# EAGLE design Eagle (EAGLE 6.3)
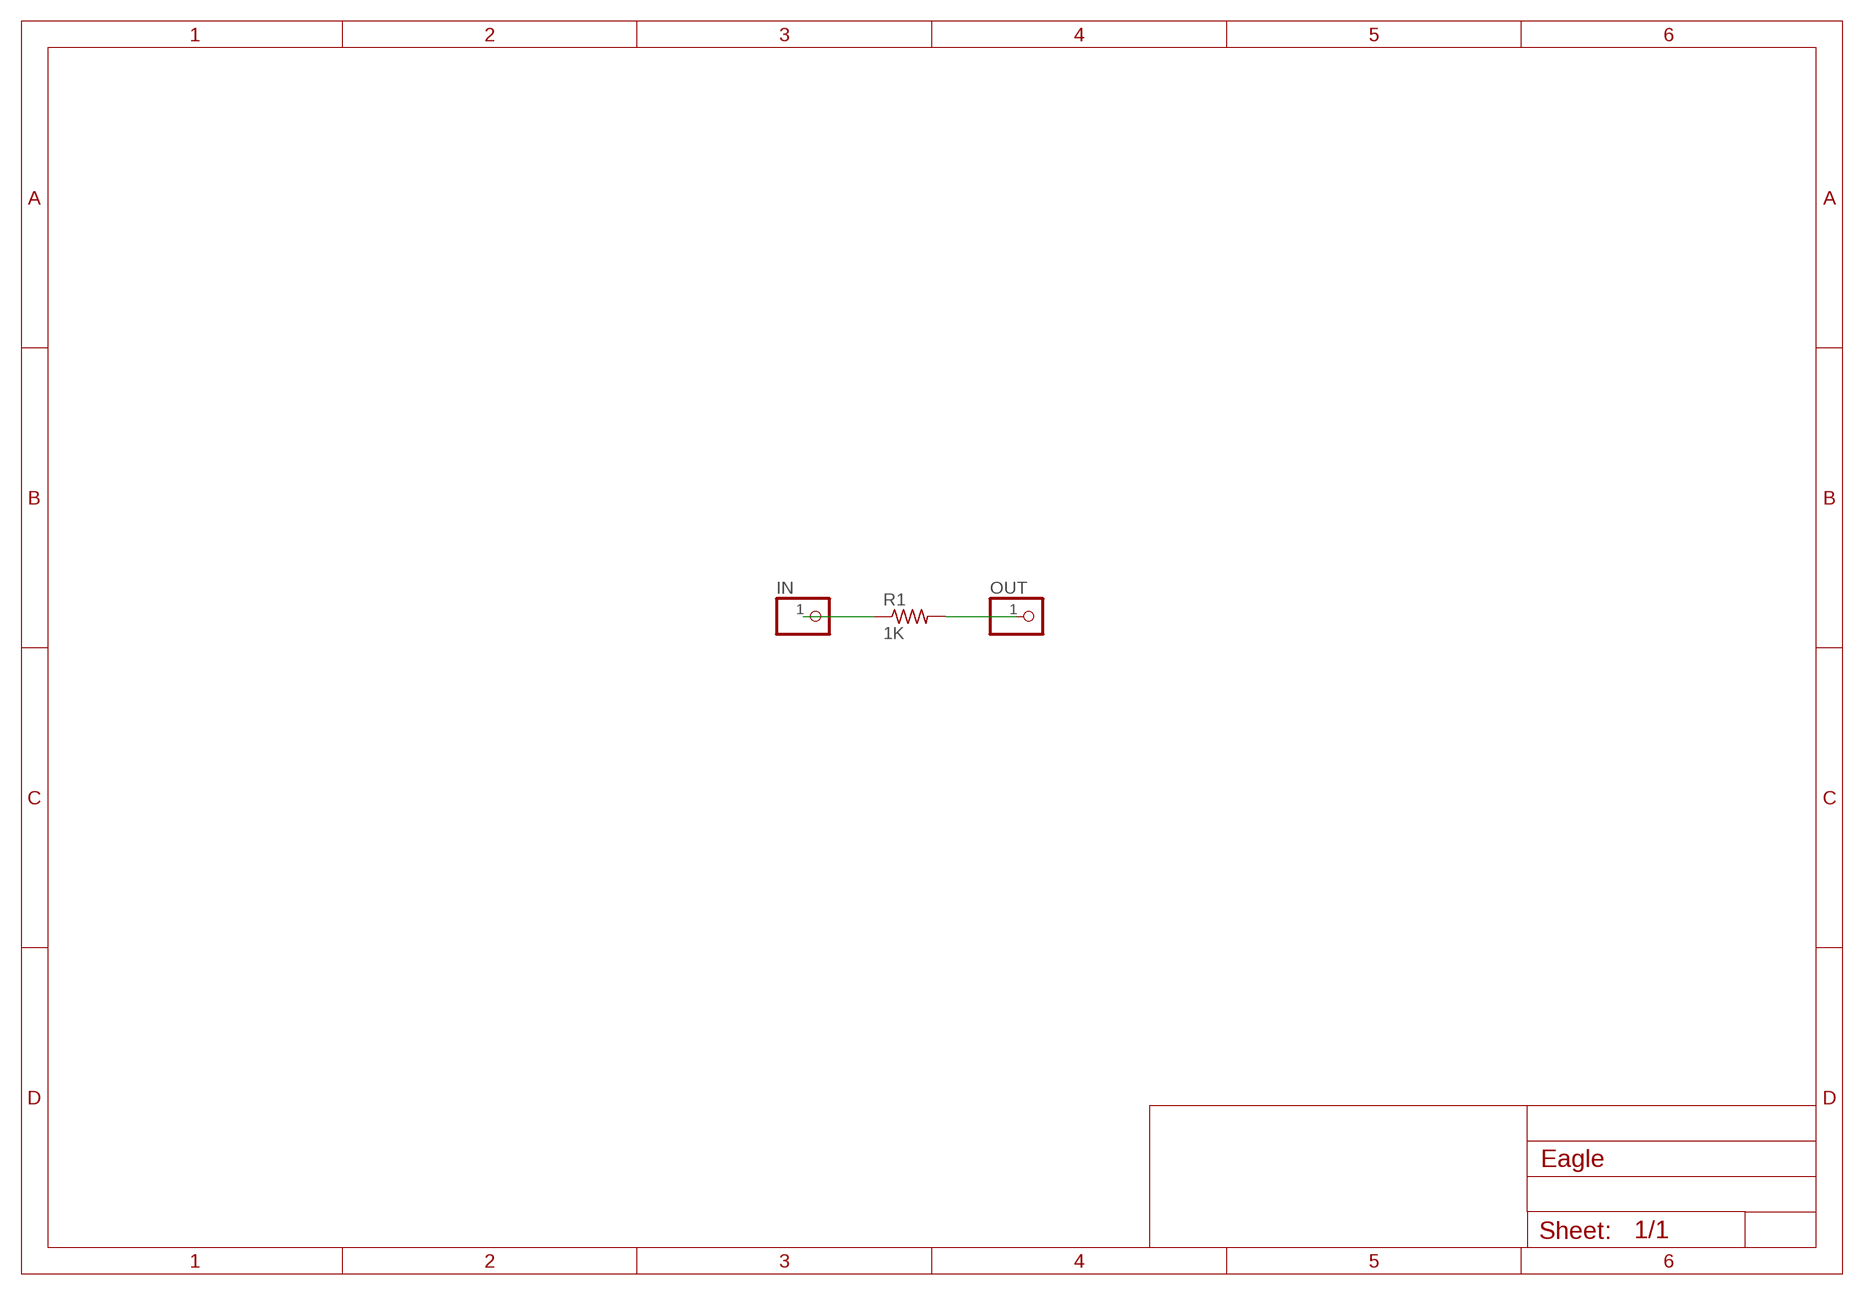
[diagram p0: schematic, sheet 1]

## Parts
IN  PINHD-1X1  [1X01]
OUT  PINHD-1X1  [1X01]
R1  1K  R-US_R0805  [R0805]

## Nets
N$1: IN.1 R1.1
N$2: OUT.1 R1.2

## Library data of the parts
IN OUT = pinhead:PINHD-1X1: PIN HEADER
R1 = rcl:R-US_: RESISTOR, American symbol

## Board
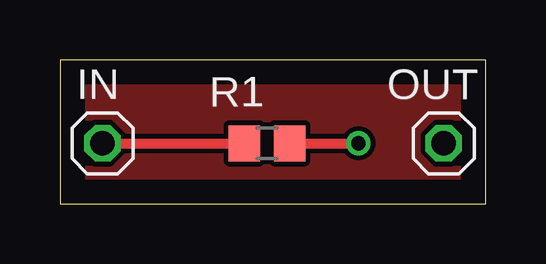
[diagram p1: board, top side]
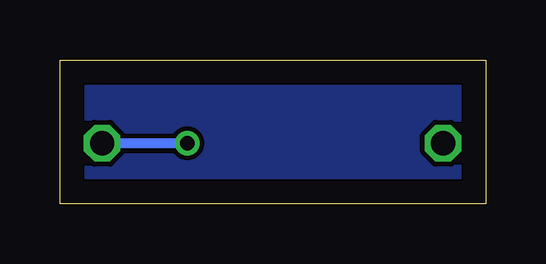
[diagram p2: board, bottom side, seen from below]

Size 17.76 x 6.02 mm. Coordinates in mm from the lower left corner, seen from the top.
Outline: 0,0 17.76,0 17.76,6.02 0,6.02 0,0
Copper layers (1*16): Top 0.035mm / dielectric 1.5mm / Bottom 0.035mm
Design rules "default": minimum track width 10mil, minimum drill 24mil, track to track 8mil, track to pad 8mil, pad to pad 8mil, via to via 8mil, smd to smd 8mil, copper to edge 40mil, drill to drill 8mil, minimum pad ring 10mil, minimum via ring 8mil, stop-mask expansion 4mil, vias tented up to drill 0mil, thermal gap 10mil

### Footprints (pad centres in the part's own frame; a part is rotated, then mirrored left to right if it is on the bottom)
1X01 = drill 1.016 octagon: 1 0,0
R0805 = smd 1.3 x 1.5: 1 -0.95,0; 2 0.95,0

### Placement (x,y rotation side)
IN  1.78,2.54 0 top
OUT  16,2.54 0 top
R1  8.64,2.54 0 top

### Tracks (layer width: path | path; a pad name or v marks a point on that pad's centre or on a via)
GND
  pour Bottom: -0.25,-0.25 -0.25,6.35 18.03,6.35 18.03,-0.25
  pour Top: -0.51,6.6 18.29,6.6 18.29,-0.51 -0.51,-0.51
N$1
  Top 0.406: IN.1 R1.1
N$2  (via drill 0.6)
  Top 0.406: R1.2 v12.45,2.54
  Bottom 0.406: v12.45,2.54 OUT.1